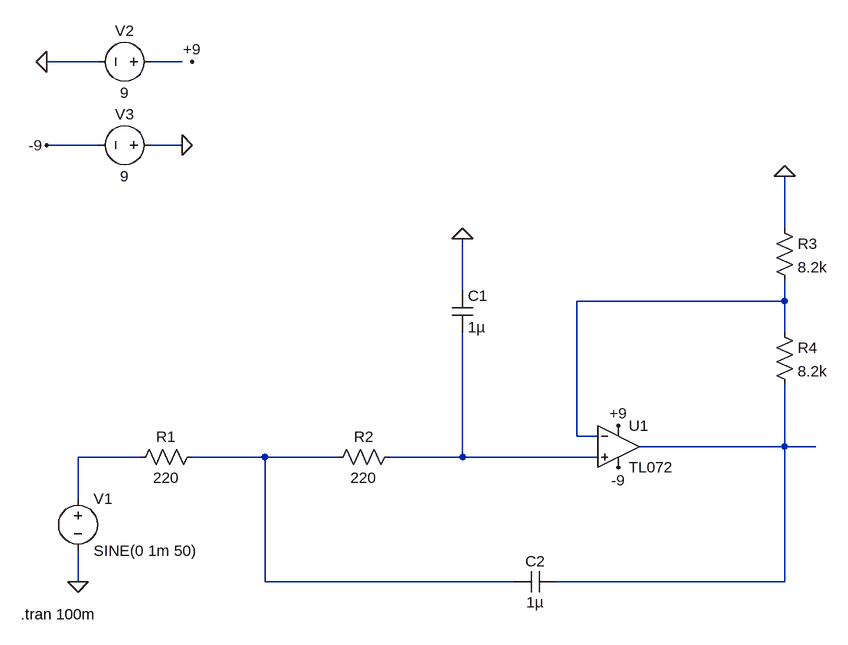
[diagram p0: schematic Draft69.asc]
Draft69.asc, the LTspice schematic file:
Version 4
SHEET 1 1188 680
WIRE -16 -432 -96 -432
WIRE 112 -432 64 -432
WIRE -16 -304 -96 -304
WIRE 112 -304 64 -304
WIRE 1040 -176 1040 -256
WIRE 544 -80 544 -160
WIRE 1040 -64 1040 -96
WIRE 1040 -64 720 -64
WIRE 1040 -16 1040 -64
WIRE 720 144 720 -64
WIRE 752 144 720 144
WIRE 1040 160 1040 64
WIRE 1040 160 816 160
WIRE 1088 160 1040 160
WIRE 48 176 -48 176
WIRE 240 176 128 176
WIRE 352 176 240 176
WIRE 544 176 544 -16
WIRE 544 176 432 176
WIRE 752 176 544 176
WIRE -48 240 -48 176
WIRE -48 368 -48 320
WIRE 240 368 240 176
WIRE 624 368 240 368
WIRE 1040 368 1040 160
WIRE 1040 368 688 368
FLAG 544 -160 0
FLAG 1040 -256 0
FLAG -48 368 0
FLAG 112 -304 0
FLAG -96 -432 0
FLAG 128 -432 +9
FLAG -96 -304 -9
FLAG 784 128 +9
FLAG 784 192 -9
SYMBOL res 144 160 R90
WINDOW 0 0 56 VBottom 2
WINDOW 3 32 56 VTop 2
SYMATTR InstName R1
SYMATTR Value 220
SYMBOL res 448 160 R90
WINDOW 0 0 56 VBottom 2
WINDOW 3 32 56 VTop 2
SYMATTR InstName R2
SYMATTR Value 220
SYMBOL cap 528 -80 R0
SYMATTR InstName C1
SYMATTR Value 1µ
SYMBOL cap 688 352 R90
WINDOW 0 0 32 VBottom 2
WINDOW 3 32 32 VTop 2
SYMATTR InstName C2
SYMATTR Value 1µ
SYMBOL res 1024 -192 R0
SYMATTR InstName R3
SYMATTR Value 8.2k
SYMBOL res 1024 -32 R0
SYMATTR InstName R4
SYMATTR Value 8.2k
SYMBOL OpAmps\\TL072 784 96 R0
SYMATTR InstName U1
SYMBOL voltage -48 224 R0
WINDOW 123 0 0 Left 0
WINDOW 39 0 0 Left 0
SYMATTR InstName V1
SYMATTR Value SINE(0 1m 50)
SYMBOL voltage 80 -432 R90
WINDOW 0 -32 56 VBottom 2
WINDOW 3 32 56 VTop 2
WINDOW 123 0 0 Left 0
WINDOW 39 0 0 Left 0
SYMATTR InstName V2
SYMATTR Value 9
SYMBOL voltage 80 -304 R90
WINDOW 0 -32 56 VBottom 2
WINDOW 3 32 56 VTop 2
WINDOW 123 0 0 Left 0
WINDOW 39 0 0 Left 0
SYMATTR InstName V3
SYMATTR Value 9
TEXT -136 418 Left 2 !.tran 100m

The netlist it stands for:
* Draft69.asc
R1 N005 N004 220
R2 N006 N005 220
C1 0 N006 1µ
C2 N003 N005 1µ
R3 0 N002 8.2k
R4 N002 N003 8.2k
XU1 N006 N002 +9 -9 N003 TL072  ; pins In+ In- V+ V- OUT
V1 N004 0 SINE(0 1m 50)
V2 N001 0 9
V3 0 -9 9
.tran 100m
.backanno
.end